# Altium schematic sheet 34.SchDoc
size A4
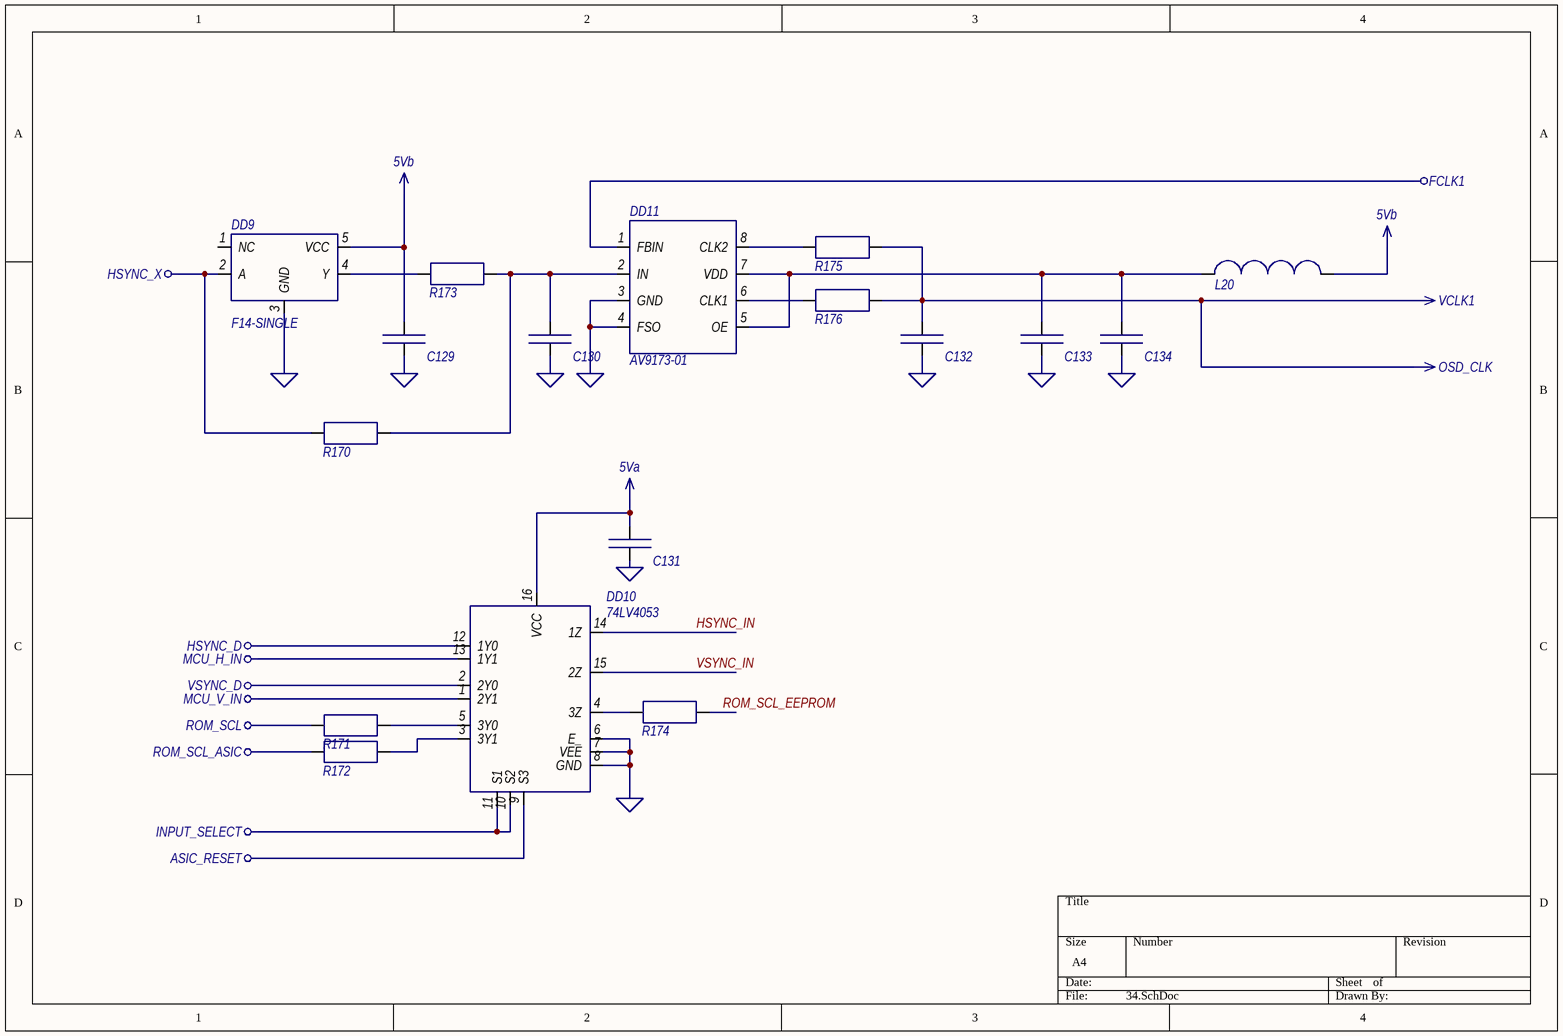
[diagram p0: 34.SchDoc]

## Parts
C129  Capacitor  [cap_electro_13]  (value not drawn)
C130  Capacitor  [cap_electro_13]  (value not drawn)
C131  Capacitor  [cap_electro_13]  (value not drawn)
C132  Capacitor  [cap_electro_13]  (value not drawn)
C133  Capacitor  [cap_electro_13]  (value not drawn)
C134  Capacitor  [cap_electro_13]  (value not drawn)
DD9  F14-SINGLE  [74AHC1G14(SOT25)]
DD10  74LV4053  [74LV4053(SOT38-4)]
DD11  AV9173-01  [AV9173-01(DIP8)]
L20  Inductor  [inductor]  (value not drawn)
R170  Resistor  [R_1206]  (value not drawn)
R171  Resistor  [R_1206]  (value not drawn)
R172  Resistor  [R_1206]  (value not drawn)
R173  Resistor  [R_1206]  (value not drawn)
R174  Resistor  [R_1206]  (value not drawn)
R175  Resistor  [R_1206]  (value not drawn)
R176  Resistor  [R_1206]  (value not drawn)

## Nets
5Va: C131.2 DD10.16(VCC)
5Vb: C129.1 DD9.5(VCC) L20.2
ASIC_RESET: DD10.9(S3)
FCLK1: DD11.1(FBIN)
GND: C129.2 C130.2 C131.1 C132.2 C133.2 C134.2 DD9.3(GND) DD10.6(E_) DD10.7(VEE) DD10.8(GND) DD11.3(GND) DD11.4(FSO)
HSYNC_D: DD10.12(1Y0)
HSYNC_X: DD9.2(A) R170.1
INPUT_SELECT: DD10.10(S2) DD10.11(S1)
MCU_H_IN: DD10.13(1Y1)
MCU_V_IN: DD10.1(2Y1)
OSD_CLK: C132.1 R175.2 R176.2  [also labelled VCLK1]
ROM_SCL: R171.1
ROM_SCL_ASIC: R172.1
VSYNC_D: DD10.2(2Y0)
HSYNC_IN: DD10.14(1Z)
ROM_SCL_EEPROM: R174.2
VSYNC_IN: DD10.15(2Z)
NetC130_1: C130.1 DD11.2(IN) R170.2 R173.2
NetC133_1: C133.1 C134.1 DD11.5(OE) DD11.7(VDD) L20.1
NetDD9_4: DD9.4(Y) R173.1
NetDD10_3: DD10.3(3Y1) R172.2
NetDD10_4: DD10.4(3Z) R174.1
NetDD10_5: DD10.5(3Y0) R171.2
NetDD11_6: DD11.6(CLK1) R176.1
NetDD11_8: DD11.8(CLK2) R175.1

Not connected (* = marked no-connect by the designer): DD9 1(NC)

## Library data of the parts
DD9 = 74AHC1G14-TA